# Altium schematic sheet 4.phy2.SchDoc
size A3; Organization: Altium Limited; Address1: L3, 12a Rodborough Rd; Address2: Frenchs Forest; Address3: NSW; Address4: Australia 2086; SheetNumber: 4; SheetTotal: 4
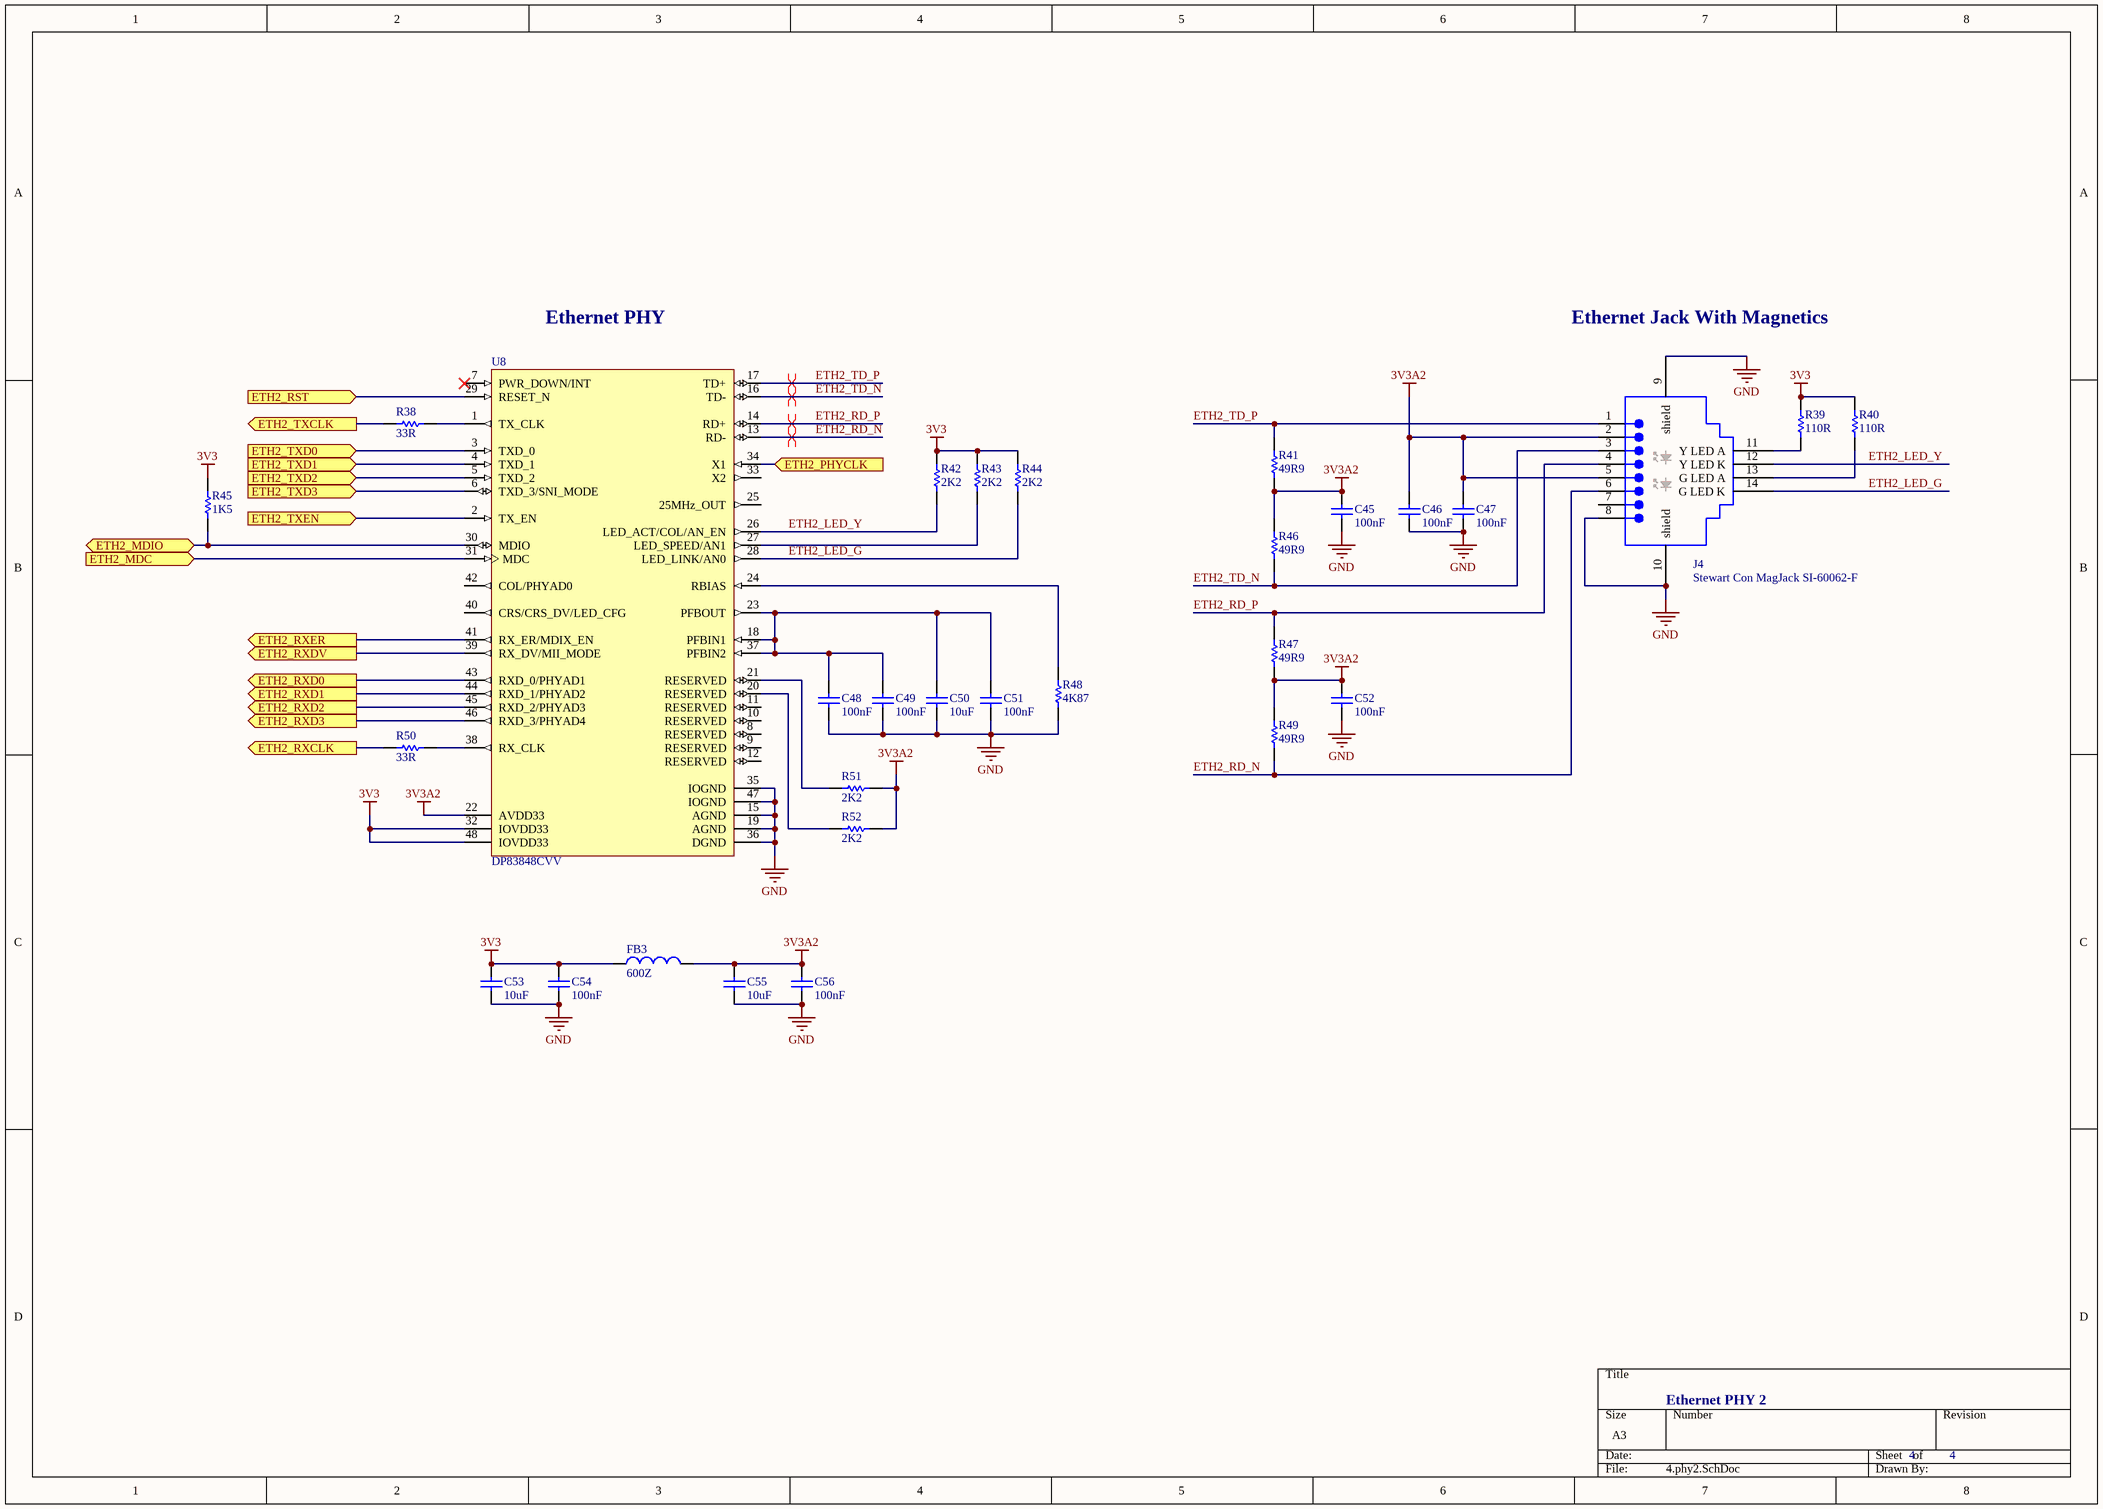
[diagram p0: 4.phy2.SchDoc]

## Parts
C45  value 100nF  [1005[0402]_CAP2]  (hidden comment: Cap)
C46  value 100nF  [1005[0402]_CAP2]  (hidden comment: Cap)
C47  value 100nF  [1005[0402]_CAP2]  (hidden comment: Cap)
C48  value 100nF  [1005[0402]_CAP2]  (hidden comment: Cap)
C49  value 100nF  [1005[0402]_CAP2]  (hidden comment: Cap)
C50  value 10uF  [1608[0603]_CAP2]  (hidden comment: Cap)
C51  value 100nF  [1005[0402]_CAP2]  (hidden comment: Cap)
C52  value 100nF  [1005[0402]_CAP2]  (hidden comment: Cap)
C53  value 10uF  [1608[0603]_CAP2]  (hidden comment: Cap)
C54  value 100nF  [1005[0402]_CAP2]  (hidden comment: Cap)
C55  value 10uF  [1608[0603]_CAP2]  (hidden comment: Cap)
C56  value 100nF  [1005[0402]_CAP2]  (hidden comment: Cap)
FB3  value 600Z  [1005[0402]_FB2]  (hidden comment: Ferrite Bead)
J4  Stewart Con MagJack SI-60062-F  [Steward Con RJ45]
R38  value 33R  [1005[0402]_RES2]  (hidden comment: Res)
R39  value 110R  [1005[0402]_RES2]  (hidden comment: Res)
R40  value 110R  [1005[0402]_RES2]  (hidden comment: Res)
R41  value 49R9  [1005[0402]_RES2]  (hidden comment: Res)
R42  value 2K2  [1005[0402]_RES2]  (hidden comment: Res)
R43  value 2K2  [1005[0402]_RES2]  (hidden comment: Res)
R44  value 2K2  [1005[0402]_RES2]  (hidden comment: Res)
R45  value 1K5  [1005[0402]_RES2]  (hidden comment: Res)
R46  value 49R9  [1005[0402]_RES2]  (hidden comment: Res)
R47  value 49R9  [1005[0402]_RES2]  (hidden comment: Res)
R48  value 4K87  [1005[0402]_RES2]  (hidden comment: Res)
R49  value 49R9  [1005[0402]_RES2]  (hidden comment: Res)
R50  value 33R  [1005[0402]_RES2]  (hidden comment: Res)
R51  value 2K2  [1005[0402]_RES2]  (hidden comment: Res)
R52  value 2K2  [1005[0402]_RES2]  (hidden comment: Res)
U8  DP83848CVV  [TSQFP50P900X900-48M]

## Ports
ETH2_MDC (in), ETH2_MDIO (bidir), ETH2_PHYCLK (in), ETH2_RST (in), ETH2_RXCLK (out), ETH2_RXD0 (out), ETH2_RXD1 (out), ETH2_RXD2 (out), ETH2_RXD3 (out), ETH2_RXDV (out), ETH2_RXER (out), ETH2_TXCLK (out), ETH2_TXD0 (in), ETH2_TXD1 (in), ETH2_TXD2 (in), ETH2_TXD3 (in), ETH2_TXEN (in)

## Nets
3V3: C53.2 C54.2 FB3.1 R39.2 R40.2 R42.2 R43.2 R44.2 R45.2 U8.32(IOVDD33) U8.48(IOVDD33)
3V3A2: C45.2 C46.2 C47.2 C52.2 C55.2 C56.2 FB3.2 J4.2 J4.5 R41.1 R46.2 R47.1 R49.2 R51.1 R52.1 U8.22(AVDD33)
GND: C45.1 C46.1 C47.1 C48.1 C49.1 C50.1 C51.1 C52.1 C53.1 C54.1 C55.1 C56.1 J4.8 J4.9(shield) J4.10(shield) R48.1 U8.15(AGND) U8.19(AGND) U8.35(IOGND) U8.36(DGND) U8.47(IOGND)
ETH2_LED_G: J4.14(G_LED_K) R44.1 U8.28(LED_LINK/AN0)
ETH2_LED_Y: J4.12(Y_LED_K) R42.1 U8.26(LED_ACT/COL/AN_EN)
ETH2_MDC: U8.31(MDC) ; port ETH2_MDC
ETH2_MDIO: R45.1 U8.30(MDIO) ; port ETH2_MDIO
ETH2_PHYCLK: U8.34(X1) ; port ETH2_PHYCLK
ETH2_RD_N: J4.6 R49.1 U8.13(RD-)
ETH2_RD_P: J4.4 R47.2 U8.14(RD+)
ETH2_RST: U8.29(RESET_N) ; port ETH2_RST
ETH2_RXCLK: R50.1 ; port ETH2_RXCLK
ETH2_RXD0: U8.43(RXD_0/PHYAD1) ; port ETH2_RXD0
ETH2_RXD1: U8.44(RXD_1/PHYAD2) ; port ETH2_RXD1
ETH2_RXD2: U8.45(RXD_2/PHYAD3) ; port ETH2_RXD2
ETH2_RXD3: U8.46(RXD_3/PHYAD4) ; port ETH2_RXD3
ETH2_RXDV: U8.39(RX_DV/MII_MODE) ; port ETH2_RXDV
ETH2_RXER: U8.41(RX_ER/MDIX_EN) ; port ETH2_RXER
ETH2_TD_N: J4.3 R46.1 U8.16(TD-)
ETH2_TD_P: J4.1 R41.2 U8.17(TD+)
ETH2_TXCLK: R38.1 ; port ETH2_TXCLK
ETH2_TXD0: U8.3(TXD_0) ; port ETH2_TXD0
ETH2_TXD1: U8.4(TXD_1) ; port ETH2_TXD1
ETH2_TXD2: U8.5(TXD_2) ; port ETH2_TXD2
ETH2_TXD3: U8.6(TXD_3/SNI_MODE) ; port ETH2_TXD3
ETH2_TXEN: U8.2(TX_EN) ; port ETH2_TXEN
NetC48_2: C48.2 C49.2 C50.2 C51.2 U8.18(PFBIN1) U8.23(PFBOUT) U8.37(PFBIN2)
NetJ4_11: J4.11(Y_LED_A) R39.1
NetJ4_13: J4.13(G_LED_A) R40.1
NetR38_2: R38.2 U8.1(TX_CLK)
NetR43_1: R43.1 U8.27(LED_SPEED/AN1)
NetR48_2: R48.2 U8.24(RBIAS)
NetR50_2: R50.2 U8.38(RX_CLK)
NetR51_2: R51.2 U8.21(RESERVED)
NetR52_2: R52.2 U8.20(RESERVED)

Not connected (* = marked no-connect by the designer): J4 7; U8 7(PWR_DOWN/INT)* 8(RESERVED) 9(RESERVED) 10(RESERVED) 11(RESERVED) 12(RESERVED) 25(25MHz_OUT) 33(X2) 40(CRS/CRS_DV/LED_CFG) 42(COL/PHYAD0)

## Layout directives
differential pair: ETH2_RD_N, ETH2_RD_P, ETH2_TD_N, ETH2_TD_P

## Notes on the sheet
- Ethernet PHY
- Ethernet Jack With Magnetics
- Ethernet PHY 2
- Title
- Size:
- Date:
- A3
- Number:
- Time:
- Revision:
- Sheet
- of
- File:

## Library data of the parts
C45-C49 C51 C52 C54 C56 = Cap: Capacitor; Manufacturer: SAMSUNG; ProductCode: CL05B104KO5NNNC; Vendor: Digikey; VendorCode: 1276-1001-1-ND; Published: 8-Jun-2000; LatestRevisionDate: 17-Jul-2002; LatestRevisionNote: Re-released for DXP Platform.; PackageReference: RAD-0.3; Publisher: Altium Limited; Price: 0,01
C50 C53 C55 = Cap: Capacitor; Manufacturer: SAMSUNG; VendorCode: 1276-6775-1-ND; Vendor: Digikey; ProductCode: CL10A106MPNNHBC; Published: 8-Jun-2000; LatestRevisionDate: 17-Jul-2002; LatestRevisionNote: Re-released for DXP Platform.; PackageReference: RAD-0.3; Publisher: Altium Limited; Price: 0,22
FB3 = Ferrite Bead: Manufacturer: MURATA; Code_IEC: 1005; ProductCode: BLM15AX601SN1D; Vendor: Digikey; VendorCode: 490-5441-1-ND; Published: 8-Jun-2000; LatestRevisionDate: 29-May-2009; LatestRevisionNote: IPC-7351 Footprint Added.; PackageReference: 0402-A; Publisher: Altium Limited; PackageDescription: Chip Inductor; Code_JEITA: 0402; Price: 0,11
J4 = Steward con RJ45 with magnetics: Right Angle,RJ45-Keyed, Flange Mount PCB Jack; Manufacturer: STEWART CONNECTOR; Ports: 1; Positions/Loaded: Port1 - 8 Keyed/8; PerformanceCategory: 3; PCB_Mounting: Thru-Hole; ComponentAvailability: Obsolete; DrillSize: Nominal, Rounded to nearest 0.05mm; PCB_Layout: Complies with Manufacturer's Recommendation.; Vendor: Digikey; VendorCode: 380-1106-ND; Published: 25-Jun-2002; DatasheetDocument: 18-Dec-2001; PackageDocument: 18-Dec-2001; PackageReference: 15-43-6233; Publisher: Altium Limited; ComponentLink1Description: Manufacturer Link; ComponentLink1URL: http://www.molex.com/; ComponentLink2Description: Datasheet; ComponentLink2URL: http://www.molex.com/cmc_upload/common_files/1212003_catalogmx41314.pdf; ComponentLink3Description: Iges Model; ComponentLink3URL: http://www.molex.com/pdm_docs/igs/15-43-6233_igs.zip; ProductCode: SI-60062-F; Price: 4,07
R38 R50 = Res: Resistor; Manufacturer: PANASONIC; Vendor: Digikey; VendorCode: P33JCT-ND; ProductCode: ERJ-2GEJ330X; Published: 8-Jun-2000; LatestRevisionDate: 17-Jul-2002; LatestRevisionNote: Re-released for DXP Platform.; PackageReference: AXIAL-0.3; Publisher: Altium Limited; Price: 0,02
R39 R40 = Res: Resistor; Manufacturer: PANASONIC; ProductCode: ERJ-2GEJ111X; VendorCode: P110JCT-ND; Vendor: Digikey; Published: 8-Jun-2000; LatestRevisionDate: 17-Jul-2002; LatestRevisionNote: Re-released for DXP Platform.; PackageReference: AXIAL-0.3; Publisher: Altium Limited; Price: 0,02
R41 R46 R47 R49 = Res: Resistor; Manufacturer: PANASONIC; ProductCode: ERJ-2RKF49R9X; VendorCode: P49.9LCT-ND; Vendor: Digikey; Published: 8-Jun-2000; LatestRevisionDate: 17-Jul-2002; LatestRevisionNote: Re-released for DXP Platform.; PackageReference: AXIAL-0.3; Publisher: Altium Limited; Price: 0,02
R42-R44 R51 R52 = Res: Resistor; Manufacturer: PANASONIC; Vendor: Digikey; VendorCode: P2.20KLCT-ND; ProductCode: ERJ-2RKF2201X; Published: 8-Jun-2000; LatestRevisionDate: 17-Jul-2002; LatestRevisionNote: Re-released for DXP Platform.; PackageReference: AXIAL-0.3; Publisher: Altium Limited; Price: 0,02
R45 = Res: Resistor; Manufacturer: PANASONIC; ProductCode: ERJ-2RKF1501X; VendorCode: P1.50KLCT-ND; Vendor: Digikey; Published: 8-Jun-2000; LatestRevisionDate: 17-Jul-2002; LatestRevisionNote: Re-released for DXP Platform.; PackageReference: AXIAL-0.3; Publisher: Altium Limited; Price: 0,09
R48 = Res: Resistor; Manufacturer: PANASONIC; ProductCode: ERJ-2RKF4871X; VendorCode: P4.87KLCT-ND; Vendor: Digikey; Published: 8-Jun-2000; LatestRevisionDate: 17-Jul-2002; LatestRevisionNote: Re-released for DXP Platform.; PackageReference: AXIAL-0.3; Publisher: Altium Limited; Price: 0,02
U8 = DP83848CVV: PHYTER® Commercial Temperature Single Port 10/100 Mb/s Ethernet Physical Layer Transceiver, 48-pin LQFP; Manufacturer: TEXAS INSTRUMENTS; PackageTopMarking: NSUZXYTT*DP83848VV*VBC; PowerWise: N; CompType: Interface IC; ProductCode: DP83848CVVX/NOPB; VendorCode: DP83848CVVX/NOPBCT-ND; Vendor: Digikey; Published: 4-Dec-2008; DatasheetVersion: May-2008; PackageVersion: revE, May-2007; PackageReference: VBH48A; Publisher: Altium Limited; PackageDescription: LQFP, 7 x 7 x 1.4mm, 48 Lead, 0.5mm Pitch; Supplier 1: Farnell; Supplier Part Number 1: 1286816; Supplier 2: Farnell; Supplier Part Number 2: 1528379; PartNumber: DP83848CVV; RoHS: Y; PinCount: 48; ComponentLink1Description: DP83848C Datasheet; ComponentLink1URL: http://www.national.com/ds/DP/DP83848C.pdf; ComponentLink2Description: DP83848C Web Page; ComponentLink2URL: http://www.national.com/pf/DP/DP83848C.html; ComponentLink3Description: VBH48A Package Page; ComponentLink3URL: http://www.national.com/packaging/folders/vbh48a.html; Price: 4,94